# EAGLE schematic Uloha1 (EAGLE 9.6.2)
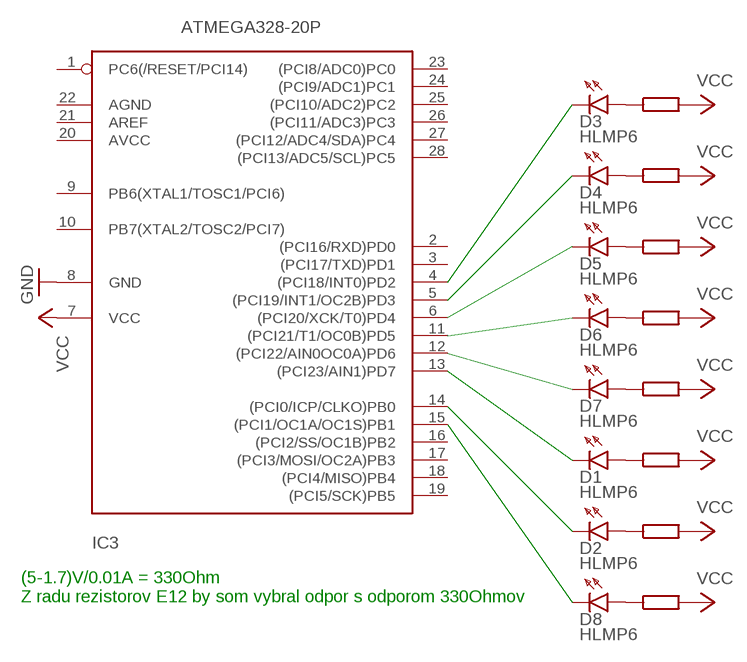
[diagram p0: schematic, sheet 1]

## Parts
D1  HLMP6  [HLMP6]
D2  HLMP6  [HLMP6]
D3  HLMP6  [HLMP6]
D4  HLMP6  [HLMP6]
D5  HLMP6  [HLMP6]
D6  HLMP6  [HLMP6]
D7  HLMP6  [HLMP6]
D8  HLMP6  [HLMP6]
IC3  ATMEGA328-20P  [DIL28-3]

## Nets
GND: IC3.8(GND)
N$1: D3.K IC3.4((PCI18/INT0)PD2)
N$2: D4.K IC3.5((PCI19/INT1/OC2B)PD3)
N$3: D5.K IC3.6((PCI20/XCK/T0)PD4)
N$4: D6.K IC3.11((PCI21/T1/OC0B)PD5)
N$5: D7.K IC3.12((PCI22/AIN0OC0A)PD6)
N$6: D1.K IC3.13((PCI23/AIN1)PD7)
N$7: D2.K IC3.14((PCI0/ICP/CLKO)PB0)
N$8: D8.K IC3.15((PCI1/OC1A/OC1S)PB1)
VCC: IC3.7(VCC)
Unconnected: D1.A D2.A D3.A D4.A D5.A D6.A D7.A D8.A IC3.1(PC6(/RESET/PCI14)) IC3.2((PCI16/RXD)PD0) IC3.3((PCI17/TXD)PD1) IC3.9(PB6(XTAL1/TOSC1/PCI6)) IC3.10(PB7(XTAL2/TOSC2/PCI7)) IC3.16((PCI2/SS/OC1B)PB2) IC3.17((PCI3/MOSI/OC2A)PB3) IC3.18((PCI4/MISO)PB4) IC3.19((PCI5/SCK)PB5) IC3.20(AVCC) IC3.21(AREF) IC3.22(AGND) IC3.23((PCI8/ADC0)PC0) IC3.24((PCI9/ADC1)PC1) IC3.25((PCI10/ADC2)PC2) IC3.26((PCI11/ADC3)PC3) IC3.27((PCI12/ADC4/SDA)PC4) IC3.28((PCI13/ADC5/SCL)PC5)

## Notes on the sheet
- (5-1.7)V/0.01A = 330Ohm
  Z radu rezistorov E12 by som vybral odpor s odporom 330Ohmov

## Library data of the parts
D1-D8 = display-hp:HLMP6: LED 2mm horizontal; MF: AGILENT TECHNOLOGIES; MPN: HLMP-6500; OC_FARNELL: 1652490; OC_NEWARK: 40K0088
IC3 = atmega328:ATMEGA328*P: MICROCONTROLLER 32 kBytes FLASH 2 kBytes SRAM 1 kBytes EEPROM USART 8-channel 10 bit ADC